# EAGLE design EC Feather Breakout 3.2 (EAGLE 9.5.1)
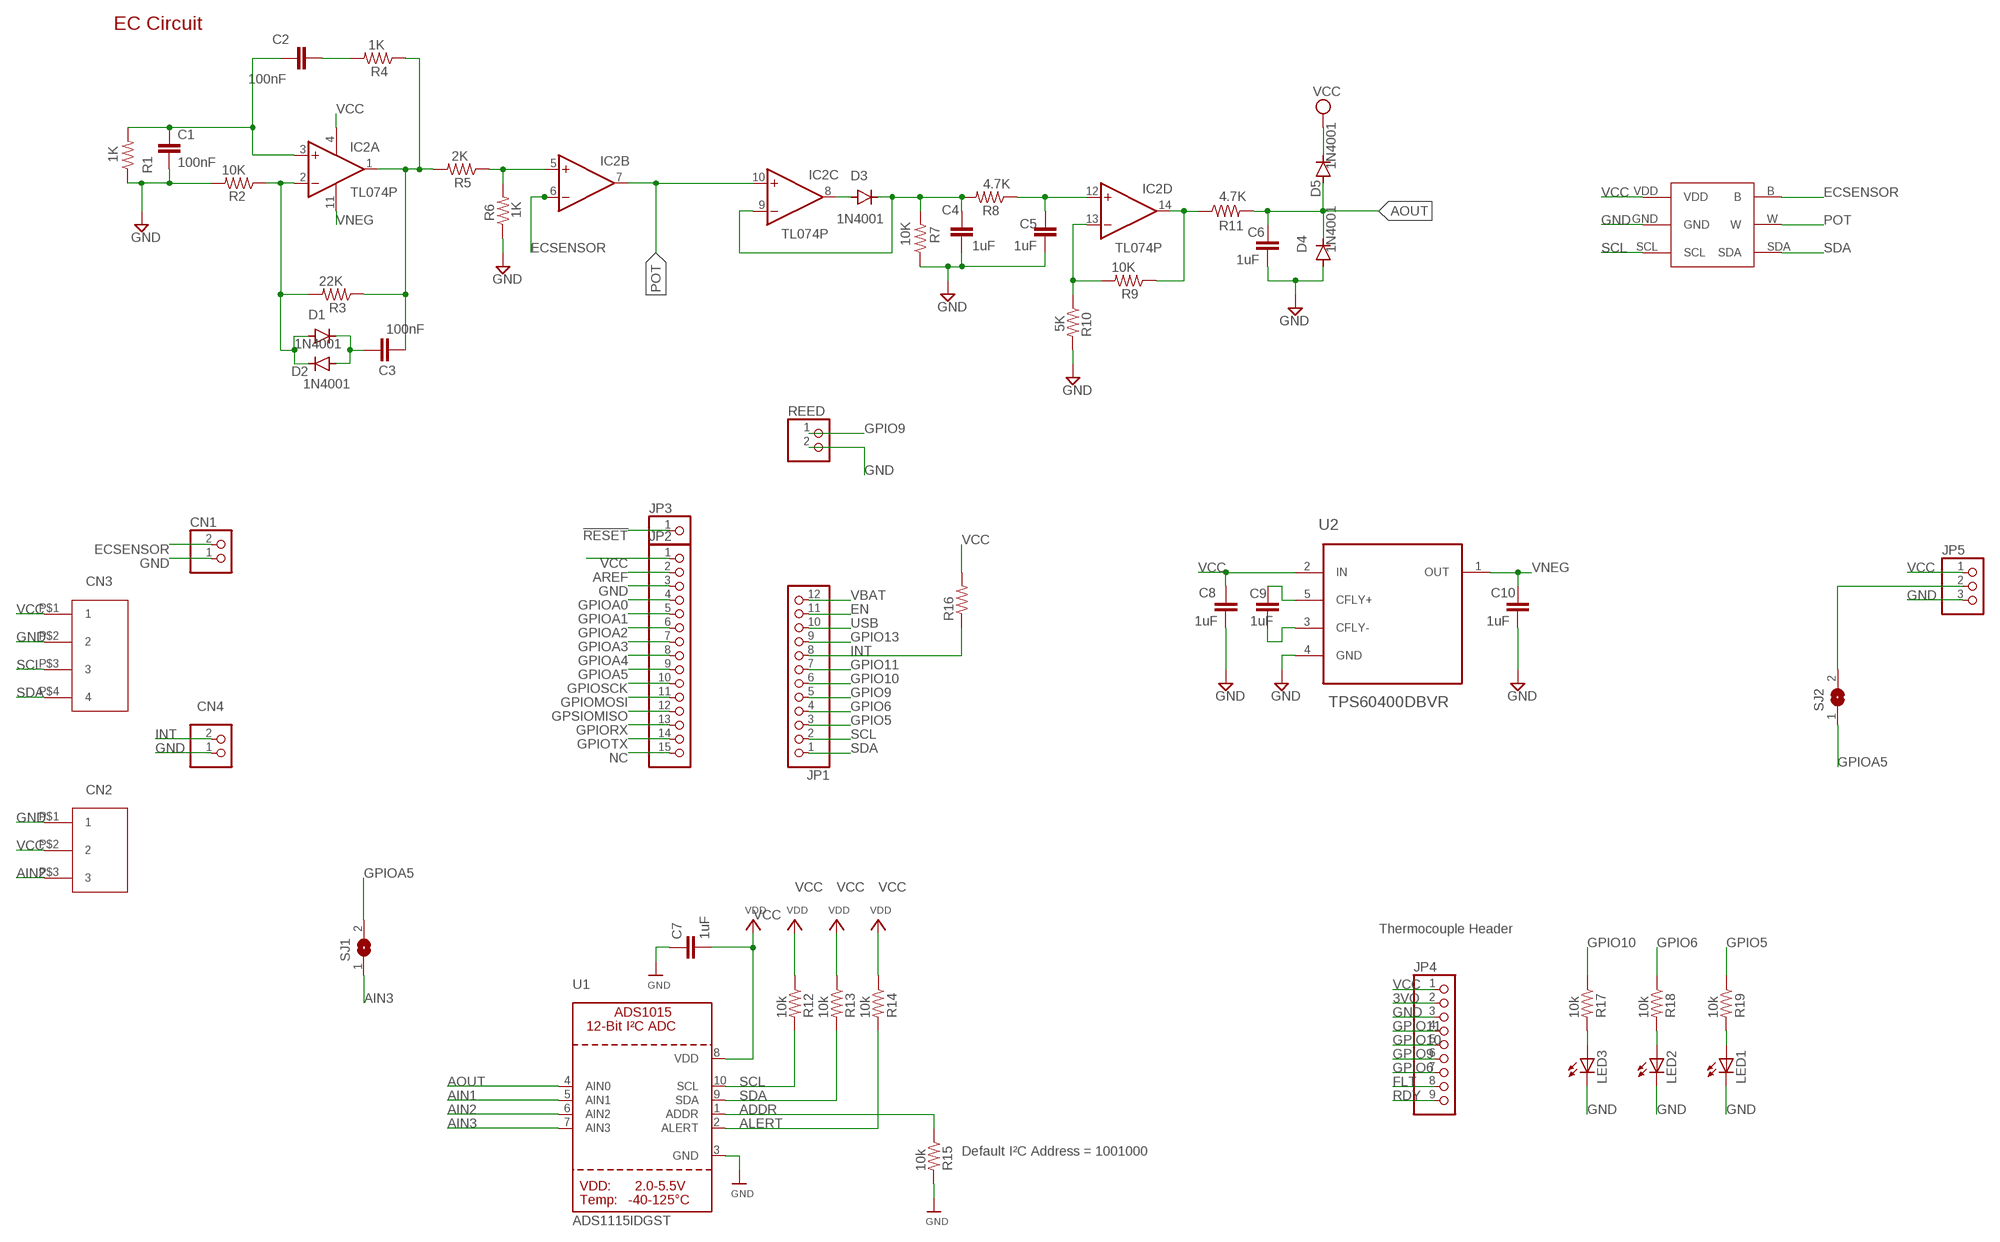
[diagram p0: schematic, sheet 1]

## Parts
C1  100nF  C-EUC1206  [C1206]
C2  100nF  C-EUC1206  [C1206]
C3  100nF  C-EUC1206  [C1206]
C4  1uF  C-EUC1206  [C1206]
C5  1uF  C-EUC1206  [C1206]
C6  1uF  C-EUC1206  [C1206]
C7  1uF  C-EUC1206  [C1206]
C8  1uF  C-EUC1206  [C1206]
C9  1uF  C-EUC1206  [C1206]
C10  1uF  C-EUC1206  [C1206]
CN1  JST_2PIN-THM  [JST-PH-2-THM]
CN4  JST_2PIN-THM  [JST-PH-2-THM]
D1  1N4001  DIODE-D-5  [D-5]
D2  1N4001  DIODE-D-5  [D-5]
D3  1N4001  DIODE-D-5  [D-5]
D4  1N4001  DIODE-D-5  [D-5]
D5  1N4001  DIODE-D-5  [D-5]
IC2  TL074P  [DIL14]
JP1  PINHD-1X12-CB  [1X12-CB]
JP2  PINHD-1X15-CB  [1X15-CB]
JP3  PINHD-1X1CB  [1X01-CLEANBIG]
JP4  PINHD-1X9  [1X09]
JP5  PINHD-1X3CB  [1X03-CLEANBIG]
LED1  LEDSMT1206  [1206]
LED2  LEDSMT1206  [1206]
LED3  LEDSMT1206  [1206]
R1  1K  R-US_R1206  [R1206]
R2  10K  R-US_R1206  [R1206]
R3  22K  R-US_R1206  [R1206]
R4  1K  R-US_R1206  [R1206]
R5  2K  R-US_R1206  [R1206]
R6  1K  R-US_R1206  [R1206]
R7  10K  R-US_R1206  [R1206]
R8  4.7K  R-US_R1206  [R1206]
R9  10K  R-US_R1206  [R1206]
R10  5K  R-US_R1206  [R1206]
R11  4.7K  R-US_R1206  [R1206]
R12  10k  R-US_R1206  [R1206]
R13  10k  R-US_R1206  [R1206]
R14  10k  R-US_R1206  [R1206]
R15  10k  R-US_R1206  [R1206]
R16  R-US_M1206  [M1206]
R17  10k  R-US_R1206  [R1206]
R18  10k  R-US_R1206  [R1206]
R19  10k  R-US_R1206  [R1206]
REED  PINHD-1X2  [1X02]
SJ1  SJ  [SJ]
SJ2  SJ  [SJ]
U1  ADS1115IDGST  ADC_ADS1015  [MSOP10]
U2  TPS60400DBVR  [SOT95P280X145-5N]
U$1  AD5246  [AD5246]
U$7  JST_4PIN_2MM  [JST_4PIN_2MM]
U$9  JST_3PIN_2MM  [JST_3PIN_2MM]

## Nets
3VO: JP4.2
!RESET: JP3.1
ADDR: R15.1 U1.1(ADDR)
AIN1: U1.5(AIN1)
AIN2: U1.6(AIN2) U$9.P$3
AIN3: SJ1.1 U1.7(AIN3)
ALERT: R14.2 U1.2(ALERT)
AOUT: C6.2 D4.C D5.A R11.2 U1.4(AIN0)
AREF: JP2.2
ECSENSOR: CN1.2 IC2.6(B:-IN) U$1.B
EN: JP1.11
FLT: JP4.8
GND: C1.2 C4.1 C5.1 C6.1 C7.1 C8.1 C10.1 CN1.1 CN4.1 D4.A JP2.3 JP4.3 JP5.3 LED1.C LED2.C LED3.C R1.1 R2.2 R6.1 R7.1 R10.2 R15.2 REED.2 U1.3(GND) U2.4(GND) U$1.GND U$7.P$2 U$9.P$1
GPIO5: JP1.3 R19.1
GPIO6: JP1.4 JP4.7 R18.1
GPIO9: JP1.5 JP4.6 REED.1
GPIO10: JP1.6 JP4.5 R17.1
GPIO11: JP1.7 JP4.4
GPIO13: JP1.9
GPIOA0: JP2.4
GPIOA1: JP2.5
GPIOA2: JP2.6
GPIOA3: JP2.7
GPIOA4: JP2.8
GPIOA5: JP2.9 SJ1.2 SJ2.1
GPIOMOSI: JP2.11
GPIORX: JP2.13
GPIOSCK: JP2.10
GPIOTX: JP2.14
GPSIOMISO: JP2.12
INT: CN4.2 JP1.8 R16.1
N$1: C1.1 C2.1 IC2.3(A:+IN) R1.2
N$2: C2.2 R4.2
N$3: C3.2 IC2.1(A:OUT) R3.1 R4.1 R5.2
N$4: D1.A D2.C IC2.2(A:-IN) R2.1 R3.2
N$5: IC2.5(B:+IN) R5.1 R6.2
N$6: JP5.2 SJ2.2
N$9: C3.1 D1.C D2.A
N$12: C4.2 D3.C IC2.9(C:-IN) R7.2 R8.2
N$13: D3.A IC2.8(C:OUT)
N$15: C5.2 IC2.12(D:+IN) R8.1
N$16: IC2.13(D:-IN) R9.2 R10.1
N$18: IC2.14(D:OUT) R9.1 R11.1
N$20: LED3.A R17.2
N$21: LED2.A R18.2
N$22: LED1.A R19.2
N$27: C9.2 U2.5(CFLY+)
N$28: C9.1 U2.3(CFLY-)
NC: JP2.15
POT: IC2.7(B:OUT) IC2.10(C:+IN) U$1.W
RDY: JP4.9
SCL: JP1.2 R12.2 U1.10(SCL) U$1.SCL U$7.P$3
SDA: JP1.1 R13.2 U1.9(SDA) U$1.SDA U$7.P$4
USB: JP1.10
VBAT: JP1.12
VCC: C7.2 C8.2 D5.C IC2.4(P:V+) JP2.1 JP4.1 JP5.1 R12.1 R13.1 R14.1 R16.2 U1.8(VDD) U2.2(IN) U$1.VDD U$7.P$1 U$9.P$2 ; supply symbol labelled VDD
VNEG: C10.2 IC2.11(P:V-) U2.1(OUT)

## Notes on the sheet
- EC Circuit
- CN3
- CN4
- CN2
- Thermocouple Header
- Default I²C Address = 1001000

## Library data of the parts
C1-C10 = rcl:C-EU: CAPACITOR, European symbol; SPICEPREFIX: C
CN1 CN4 = adafruit:JST_2PIN: JST 2-Pin Connectors of various flavors SMT-RA (S2B-PH-SM4) 4UConnector #17311 SMT (B2B-PH-SM4) THM-RA (S2B-PH) THM (B2B-PH)
D1-D5 = diode:DIODE-: DIODE
IC2 = linear:TL074: OP AMP
JP1 = adafruit:PINHD-1X12: PIN HEADER
JP2 = adafruit:PINHD-1X15: PIN HEADER
JP3 = adafruit:PINHD-1X1: Pin header 1x1 for 0.1" spacing With round pins
JP4 = pinhead:PINHD-1X9: PIN HEADER
JP5 = adafruit:PINHD-1X3: PIN HEADER
LED1-LED3 = adafruit:LED: LED OSRAM: - CHIPLED LG R971, LG N971, LY N971, LG Q971, LY Q971, LO R971, LY R971 LH N974, LH R974 LS Q976, LO Q976, LY Q976 LO Q996 - Hyper CHIPLED LW Q18S LB Q993, LB Q99A, LB R99A - SideLED LS A670, LO A670, LY A670, LG A670, LP A670 LB A673, LV A673, LT A673, LW A673 LH A674 LY A675 LS A676, LA A676, LO A676, LY A676, LW A676 LS A679, LY A679, LG A679 - Hyper Micro SIDELED® LS Y876, LA Y876, LO Y876, LY Y876 LT Y87S - SmartLED LW L88C, LW L88S LB L89C, LB L89S, LG L890 LS L89K, LO L89K, LY L89K LS L896, LA L896, LO L896, LY L896 - TOPLED LS T670, LO T670, LY T670, LG T670, LP T670 LSG T670, LSP T670, LSY T670, LOP T670, LYG T670 LG T671, LOG T671, LSG T671 LB T673, LV T673, LT T673, LW T673 LH T674 LS T676, LA T676, LO T676, LY T676, LB T676, LH T676, LSB T676, LW T676 LB T67C, LV T67C, LT T67C, LS T67K, LO T67K, LY T67K, LW E67C LS E67B, LA E67B, LO E67B, LY E67B, LB E67C, LV E67C, LT E67C LW T67C LS T679, LY T679, LG T679 LS T770, LO T770, LY T770, LG T770, LP T770 LB T773, LV T773, LT T773, LW T773 LH T774 LS E675, LA E675, LY E675, LS T675 LS T776, LA T776, LO T776, LY T776, LB T776 LHGB T686 LT T68C, LB T68C - Hyper Mini TOPLED® LB M676 - Mini TOPLED Santana® LG M470 LS M47K, LO M47K, LY M47K Source: http://www.osram.convergy.de/
R1-R15 R17-R19 = rcl:R-US_: RESISTOR, American symbol; SPICEPREFIX: R
R16 = adafruit:R-US_: RESISTOR, American symbol
REED = pinhead:PINHD-1X2: PIN HEADER
SJ1 SJ2 = jumper:SJ: SMD solder JUMPER
U1 = microbuilder:ADC_ADS1015: ADS1015 - 12-bit 4-Channel I2C ADC with Internal PGA VDD: 2.0-5.5V Sampling Rate: 3.3ksps Gain Settings: 2/3, 1, 2, 4, 8, 16 I2C Address: ADDR low = 1001000x, ADDR high = 1001001x Internal Comparator The ADS1015 includes an internal comparator that can be set to output a high-level on ALERT when the conversion results exceeeds a pre-defined upper level, and will deassert itself when the level falls below a pre-defined lower threshold level. It can also be set to windowed mode where the ALERT pin will be asserted if the data exceeds the upper threshold or falls below the lower threshold.
U2 = TPS60400DBVR:TPS60400DBVR: Unregulated 60mA charge pump Voltage Inverter; AVAILABILITY: Unavailable; DESCRIPTION: 60mA Charge Pump Voltage Inverter with Variable Switching Frequency 5-SOT-23 -40 to 85; MF: Texas Instruments; MP: TPS60400DBVR; PACKAGE: SOT-23-5 Texas Instruments; PRICE: None
U$1 = AD5246:AD5246
U$7 = JSTconnector:JST_4PIN_2MM
U$9 = JSTconnector:JST_3PIN_2MM

## Net classes
0 default: width 0.305 mm

## Board
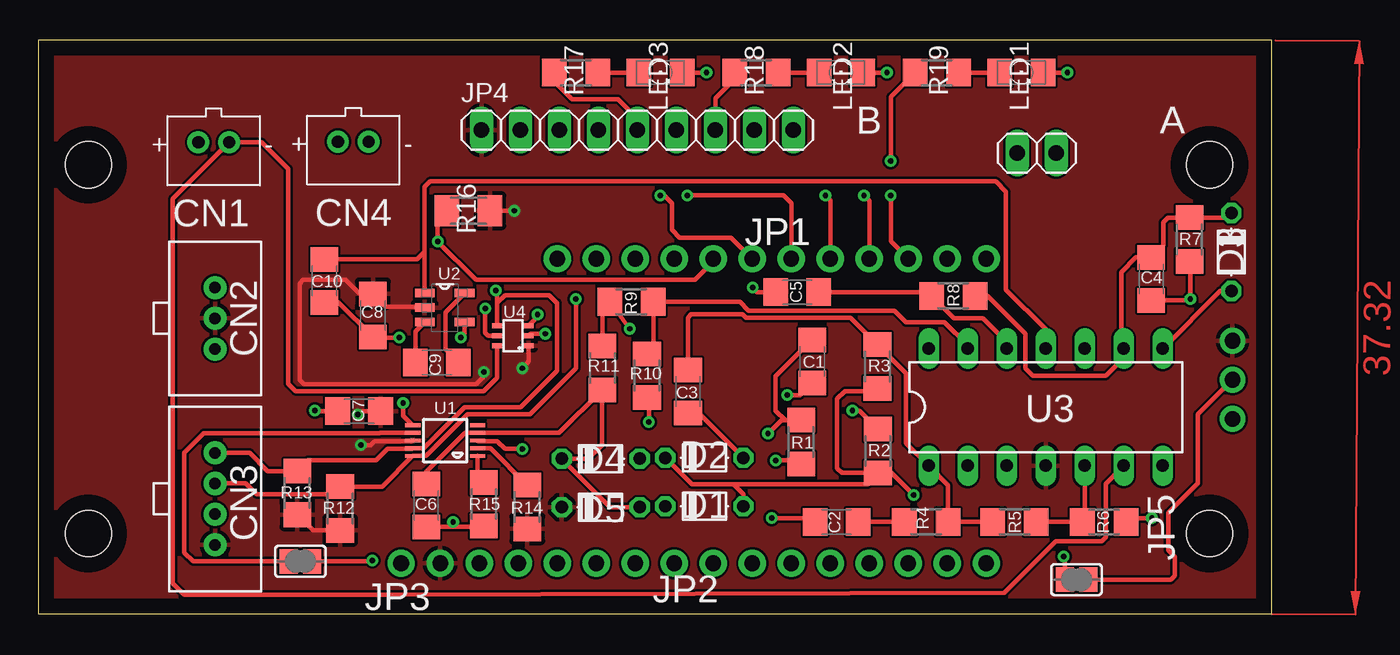
[diagram p1: board, top side]
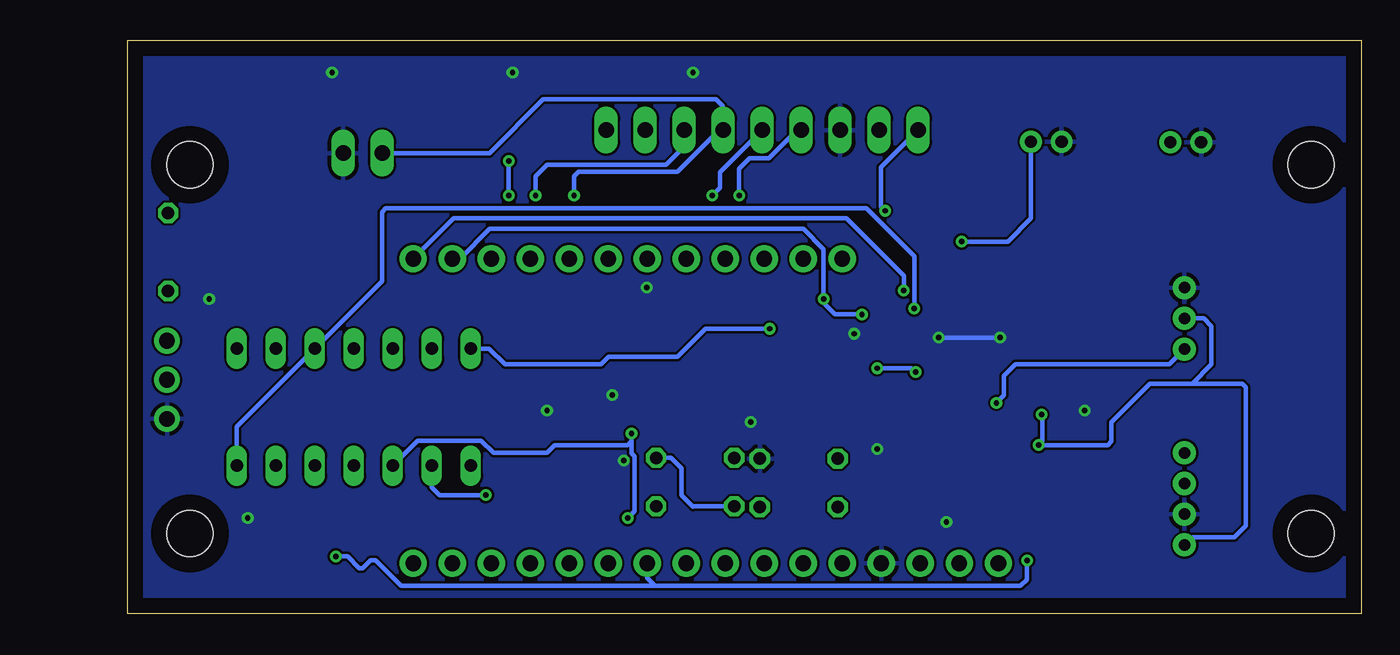
[diagram p2: board, bottom side, seen from below]

Size 80.3 x 37.32 mm. Coordinates in mm from the lower left corner, seen from the top.
Outline: 0,0 80.3,0 80.3,37.32 0,37.32 0,0
Copper layers (1*16): Top 0.035mm / dielectric 1.5mm / Bottom 0.035mm
Design rules "default": minimum track width 6mil, minimum drill 0.35mm, track to track 6mil, track to pad 6mil, pad to pad 6mil, via to via 6mil, smd to smd 6mil, copper to edge 40mil, drill to drill 6mil, minimum pad ring 10mil, minimum via ring 8mil, stop-mask expansion 4mil, vias tented up to drill 0mil, thermal gap 10mil
Holes 3 mm at 3.25,29.23 3.25,5.23 76.25,29.23 76.25,5.23

### Footprints (pad centres in the part's own frame; a part is rotated, then mirrored left to right if it is on the bottom)
C1206 = smd 1.6 x 1.8: 1 -1.4,0; 2 1.4,0
JST-PH-2-THM = drill 0.8 pad 1.422: 1 1,0; 2 -1,0
D-5 = drill 0.813 octagon: A 2.54,0; C -2.54,0
DIL14 = drill 0.813 long: 1 -7.62,-3.81; 2 -5.08,-3.81; 3 -2.54,-3.81; 4 0,-3.81; 5 2.54,-3.81; 6 5.08,-3.81; 7 7.62,-3.81; 8 7.62,3.81; 9 5.08,3.81; 10 2.54,3.81; 11 0,3.81; 12 -2.54,3.81; 13 -5.08,3.81; 14 -7.62,3.81
1X12-CB = drill 1.016 pad 1.778: 1 -13.97,0; 2 -11.43,0; 3 -8.89,0; 4 -6.35,0; 5 -3.81,0; 6 -1.27,0; 7 1.27,0; 8 3.81,0; 9 6.35,0; 10 8.89,0; 11 11.43,0; 12 13.97,0
1X15-CB = drill 1.016 pad 1.778: 1 -17.78,0; 2 -15.24,0; 3 -12.7,0; 4 -10.16,0; 5 -7.62,0; 6 -5.08,0; 7 -2.54,0; 8 0,0; 9 2.54,0; 10 5.08,0; 11 7.62,0; 12 10.16,0; 13 12.7,0; 14 15.24,0; 15 17.78,0
1X01-CLEANBIG = drill 1.016 pad 1.778: 1 0,0
1X09 = drill 1.016 long: 1 -10.16,0; 2 -7.62,0; 3 -5.08,0; 4 -2.54,0; 5 0,0; 6 2.54,0; 7 5.08,0; 8 7.62,0; 9 10.16,0
1X03-CLEANBIG = drill 1.016 pad 1.676: 1 -2.54,0; 2 0,0; 3 2.54,0
1206 = smd 1.6 x 1.803: A -1.422,0; C 1.422,0
R1206 = smd 1.6 x 1.803: 1 -1.422,0; 2 1.422,0
M1206 = smd 1.6 x 2: 1 -1.4,0; 2 1.4,0
1X02 = drill 1.016 long: 1 -1.27,0; 2 1.27,0
SJ = smd 1.168 x 1.6: 1 -0.762,0; 2 0.762,0
MSOP10 = smd 0.25 x 1: 1 -1,-2.113; 2 -0.5,-2.113; 3 0,-2.113; 4 0.5,-2.113; 5 1,-2.113; 6 1,2.113; 7 0.5,2.113; 8 0,2.113; 9 -0.5,2.113; 10 -1,2.113
SOT95P280X145-5N = smd 1.27 x 0.559: 1 -1.295,0.94; 2 -1.295,0; 3 -1.295,-0.94; 4 1.295,-0.94; 5 1.295,0.94
AD5246 = smd 0.35 x 0.65: B -0.65,0.9; GND 0,-1.15; SCL 0.65,-1.15; SDA 0.65,0.9; VDD -0.65,-1.15; W 0,0.9
JST_4PIN_2MM = drill 0.75 pad 1.5: P$1 0,0; P$2 -2,0; P$3 -4,0; P$4 -6,0
JST_3PIN_2MM = drill 0.75 pad 1.5: P$1 -2,0; P$2 0,0; P$3 2,0

### Placement (x,y rotation side)
C1  50.38,16.43 270 top
C2  51.98,5.98 0 top
C3  42.3,14.47 90 top
C4  72.46,21.8 90 top
C5  49.4,20.93 0 top
C6  25.25,7.05 90 top
C7  20.88,13.19 0 top
C8  21.78,19.42 90 top
C9  25.95,16.35 0 top
C10  18.62,21.67 90 top
CN1  11.41,30.69 180 top
CN4  20.5,30.73 180 top
D1  43.36,7 0 top
D2  43.36,10.15 0 top
D3  77.67,23.55 270 top
D4  36.61,10.09 0 top
D5  36.61,6.94 0 top
IC2  65.59,13.45 0 top
JP1  47.75,23.11 180 top
JP2  43.94,3.29 0 top
JP3  23.62,3.29 0 top
JP4  39,31.48 0 top
JP5  77.75,15.23 270 top
LED1  64,35.23 0 top
LED2  52.25,35.23 0 top
LED3  40.5,35.23 0 top
R1  49.66,11.18 90 top
R2  54.67,10.6 90 top
R3  54.63,16.09 270 top
R4  57.81,5.98 180 top
R5  63.55,5.98 180 top
R6  69.39,5.97 180 top
R7  74.95,24.36 90 top
R8  59.58,20.68 0 top
R9  38.61,20.31 0 top
R10  39.63,15.49 270 top
R11  36.72,16 270 top
R12  19.64,6.85 90 top
R13  16.85,7.87 90 top
R14  31.83,6.95 90 top
R15  29,7.13 270 top
R16  28,26.23 0 top
R17  35,35.23 0 top
R18  46.75,35.23 0 top
R19  58.5,35.23 0 top
REED  65,29.98 0 top
SJ1  17.06,3.41 0 top
SJ2  67.59,2.22 0 top
U1  26.49,11.28 90 top
U2  26.45,19.93 0 top
U$1  30.77,18.1 90 top
U$7  11.5,4.48 270 top
U$9  11.5,19.23 270 top

### Tracks (layer width: path | path; a pad name or v marks a point on that pad's centre or on a via)
ADDR
  Top 0.305: U1.1 28.6,8.96 R15.1
AIN2  (via drill 0.35)
  Top 0.305: U1.6 23.75,12.9 v23.75,13.73
  Bottom 0.305: v23.75,13.73 23.25,14.23 23.25,15.48 22.5,16.23 12.5,16.23 U$9.P$3
AIN3
  Top 0.305: U1.7 22.25,11.78 22.21,11.74 10.76,11.74 9.5,10.48 9.5,3.98 10.07,3.41 SJ1.1
ALERT
  Top 0.305: U1.2 29.43,10.78 R14.2
AOUT
  Top 0.305: C6.2 25.25,9.23 27.8,11.78 U1.4 33.92,11.78 R11.2 36.69,14.54 36.69,10.98 35.8,10.09 D4.C 37.23,6.94 D5.A
ECSENSOR
  Top 0.305: U$1.B 29.87,15.35 29,14.48 16.75,14.48 16.25,14.98 16.25,28.98 14.54,30.69 CN1.2 8.75,27.03 8.75,1.98 9.5,1.23 22.64,1.23 62.9,1.38 66.25,4.73 69.25,4.73 69.5,4.98 69.5,8.47 IC2.6
GND  (via drill 0.35)
  Top 0.305: C10.1 19.53,20.27 C8.1 21.82,17.98 v23.5,17.98 | U2.4 27.75,18.23 v27.5,17.98 | R15.2 28.95,5.65 27,5.65 | 27,5.65 C6.1 | 27,5.65 v27,5.98 | C7.1 18.04,13.19 v18,13.23 | U1.3 28.64,11.23 29.87,11.23 30.37,10.73 v31.5,10.73 | R10.2 39.75,13.95 v39.75,12.48 | C1.2 49.58,14.23 v48.75,14.23 | C5.1 46.8,20.93 v46.5,21.23 | R1.1 49.44,9.98 v48,9.98 | R6.1 71.07,6.23 v72.5,6.23 | R2.2 53.45,13.23 v53,13.23 | U$1.GND 32.05,18.23 v33,18.23 | C4.1 74.92,20.4 v75,20.48 75,22.89 R7.1 | LED1.C v67,35.23 | LED2.C v55.25,35.23 | LED3.C v43.5,35.23
  Bottom 0.305: v27.5,17.98 v23.5,17.98
  pour Bottom: 0,37.23 80,37.23 80,0.23 0,0.23
GPIO5  (via drill 0.35)
  Top 0.305: JP1.3 55.5,24.25 v55.5,27.23 | v55.5,29.48 55.5,33.65 R19.1
  Bottom 0.305: v55.5,27.23 v55.5,29.48
GPIO6  (via drill 0.35)
  Top 0.305: JP1.4 54.1,26.88 v53.75,27.23 | R18.1 45.33,34.81 44.08,33.56 JP4.7
  Bottom 0.305: v53.75,27.23 53.75,28.48 53,29.23 45.25,29.23 44.08,30.4 JP4.7
GPIO9  (via drill 0.35)
  Top 0.305: JP1.5 51.56,26.92 v51.25,27.23
  Bottom 0.305: v51.25,27.23 51.25,28.48 50.96,28.77 44.52,28.77 41.81,31.48 JP4.6 41.54,33.02 42,33.48 53.25,33.48 56.75,29.98 REED.1
GPIO10  (via drill 0.35)
  Top 0.305: JP1.6 49.02,26.71 48.5,27.23 v42.25,27.23 | R17.1 33.58,34.65 34.75,33.48 37.75,33.48 39,32.23 JP4.5
  Bottom 0.305: v42.25,27.23 41.75,27.73 41.75,28.73 JP4.5
GPIO11  (via drill 0.35)
  Top 0.305: JP1.7 45.11,24.48 41.75,24.48 41.25,24.98 41.25,26.73 40.75,27.23 v40.5,27.23
  Bottom 0.305: v40.5,27.23 40.5,28.98 39.83,29.65 38.56,29.65 36.73,31.48 JP4.4
GPIOA5  (via drill 0.35)
  Top 0.305: SJ1.2 21.68,3.41 v21.75,3.48 | v66.75,3.73 66.83,3.65 SJ2.1
  Bottom 0.305: JP2.9 46.48,2.33 45.96,1.81 | 45.96,1.81 62.5,1.81 64.17,3.48 64.5,3.48 65,2.98 65.25,2.98 66,3.73 v66.75,3.73 | 45.96,1.81 22.17,1.81 21.75,2.23 v21.75,3.48
INT  (via drill 0.35)
  Top 0.305: JP1.8 43.94,22.92 42.75,21.73 28.5,21.73 v26,24.23 26,25.63 R16.1
  Bottom 0.305: v26,24.23 23,24.23 21.5,25.73 CN4.2
N$1  (via drill 0.35)
  Top 0.305: C1.1 48,15.45 48,13.23 48.63,12.6 | 48.63,12.6 R1.2 | v47.5,11.73 48.37,12.6 48.63,12.6 | v47.75,6.23 50.33,6.23 C2.1
  Bottom 0.305: IC2.3 61.43,11.27 57.29,11.27 56.5,10.48 53,10.48 52.5,10.98 47.75,10.98 47.5,11.23 | v47.5,11.73 47.5,11.23 | 47.5,11.23 47.5,10.45 47.32,10.26 47.32,6.66 v47.75,6.23
N$2
  Top 0.305: R4.2 C2.2
N$3
  Top 0.305: C3.2 42.3,19.28 42.5,19.48 45.85,19.48 46.06,19.27 52.88,19.27 R3.1 56.5,15.65 56.5,11.11 IC2.1 59.23,8.38 R4.1 R5.2
N$4  (via drill 0.35)
  Top 0.305: R3.2 54.44,14.48 52.5,14.48 52,13.98 52,9.48 52.31,9.17 R2.1 54.75,9.17 | 54.75,9.17 55.56,9.17 v57,7.73 | 54.75,9.17 54,8.42 45.25,8.42 | D2.C 42.55,8.42 45.25,8.42 | D1.A 45.9,7.77 45.25,8.42
  Bottom 0.305: v57,7.73 60,7.73 60.51,8.24 IC2.2
N$5
  Top 0.305: R5.1 R6.2 68.13,6.13 IC2.5
N$6
  Top 0.305: JP5.2 75.5,12.98 75.5,8.48 73.58,6.56 73.58,4.12 74,3.71 74,2.48 73.74,2.22 SJ2.2
N$9
  Top 0.305: C3.1 42.98,13.07 D2.A
  Bottom 0.305: D1.C 43.48,7 43.5,6.98 44.25,7.73 44.25,9.48 44.92,10.15 D2.A
N$12
  Top 0.305: D3.C 77.37,25.78 75,25.78 R7.2 73.55,25.78 73.25,25.48 73.25,23.99 C4.2 71.47,23.2 70.5,22.23 70.5,17.43 IC2.9 70.67,16.65 69.5,15.48 64.75,15.48 64.25,15.98 64.25,18.23 61.8,20.68 R8.2
N$13
  Top 0.305: D3.A 76.96,21.01 IC2.8
N$15
  Top 0.305: C5.2 57.91,20.93 R8.1 59.61,19.23 61.5,19.23 63.05,17.68 IC2.12
N$16
  Top 0.305: R10.1 40.04,17.32 R9.2 45.67,20.31 46.25,19.73 55.75,19.73 56.5,18.98 59,18.98 60.51,17.47 IC2.13
N$18  (via drill 0.35)
  Top 0.305: R11.1 36.72,19.84 R9.1 37.23,20.31 v38.51,18.55
  Bottom 0.305: IC2.14 56.78,17.26 55.75,16.23 49.5,16.23 49,16.73 44.5,16.73 42.68,18.55 v38.51,18.55
N$20
  Top 0.305: R17.2 LED3.A
N$21
  Top 0.305: R18.2 LED2.A
N$22
  Top 0.305: R19.2 LED1.A
N$27
  Top 0.305: U2.5 26.5,19.62 26.5,17.21 C9.2
N$28
  Top 0.305: C9.1 24.55,18.38 U2.3
POT  (via drill 0.35)
  Top 0.305: v29.1,19.88 29.1,18.28 29.28,18.1 U$1.W
  Bottom 0.305: v29.1,19.88 29.1,23.28 32.2,26.38 63.5,26.38 63.75,26.13 63.75,21.64 IC2.10 73.21,12.18 IC2.7
SCL  (via drill 0.35)
  Top 0.305: v32.5,19.48 32.5,19.32 U$1.SCL | v35,20.48 35,15.98 32,12.98 27.94,12.98 25.23,10.28 U1.10 22.37,8.27 R12.2 19.14,7.77 14.21,7.77 13.5,8.48 U$7.P$3
  Bottom 0.305: v32.5,19.48 34.25,19.48 35,20.23 v35,20.48 35,23.73 36.32,25.05 56.74,25.05 58.68,23.11 JP1.2
SDA  (via drill 0.35)
  Top 0.305: U$1.SDA 29.87,20.23 | 29.87,20.23 30.37,20.73 33.25,20.73 33.75,20.23 33.78,20.23 33.78,15.83 31.4,13.45 27.76,13.45 25.09,10.78 U1.9 24.33,10.73 24.18,10.73 22.75,10.73 22,9.98 17.54,9.98 R13.2 14.94,9.29 13.75,10.48 U$7.P$4 | 29.87,20.23 29.87,20.96 v29.78,21.05
  Bottom 0.305: v29.78,21.05 29.78,22.01 33.5,25.73 59.1,25.73 JP1.1
VCC  (via drill 0.35)
  Top 0.305: U2.2 25.11,19.98 22.62,19.98 C8.2 20.91,20.82 20,21.73 17.25,21.73 17,21.48 17,15.23 17.29,14.94 28.5,14.94 29,15.44 v29,15.73 | v31.5,15.98 31.92,16.4 U$1.VDD | R13.1 17.87,5.43 R12.1 | U1.8 24.33,11.23 21.9,11.23 21.65,10.98 v21,10.98 | v20.81,12.98 21.02,13.19 C7.2 | v31,26.23 R16.2
  Bottom 0.305: v20.81,12.98 20.75,12.92 20.75,11.23 v21,10.98 16.5,10.98 16.25,11.23 16.25,12.48 13.75,14.98 11,14.98 | v29,15.73 29.25,15.98 v31.5,15.98 | 11,14.98 9.75,16.23 9.75,18.73 10.25,19.23 U$9.P$2 | 11,14.98 7.75,14.98 7.5,14.73 7.5,5.73 8.25,4.98 11,4.98 U$7.P$1 | JP4.1 31.25,29.07 31.25,26.48 v31,26.23
  pour Top: 0,37.23 80,37.23 80,0.23 0,0.23
VNEG
  Top 0.305: 25.16,23.58 U2.1 | 25.16,23.58 24.65,23.07 C10.2 | IC2.11 65.59,18.51 63,21.1 63,27.48 62.33,28.15 25.5,28.15 25.16,27.81 25.16,23.58
(copper drawn outside any net)
  shapes: Top area x1

### Text on the board
tNames: B | A | CN1 | CN4 | JP1 | R7 | U2 | D3 | C10 | C4 | C5 | R8 | C8 | U4 | R9 | CN2 | R11 | C1 | R3 | C9 | R10 | C3 | C7 | U1 | U3 | D4 | D2 | R1 | R2 | D5 | D1 | R13 | R12 | C6 | R15 | R14 | CN3 | C2 | R4 | R5 | R6 | JP5 | JP2 | JP3